# Altium schematic sheet Khoi_Sensor.SchDoc
size A4; SheetNumber: 3; SheetTotal: 6
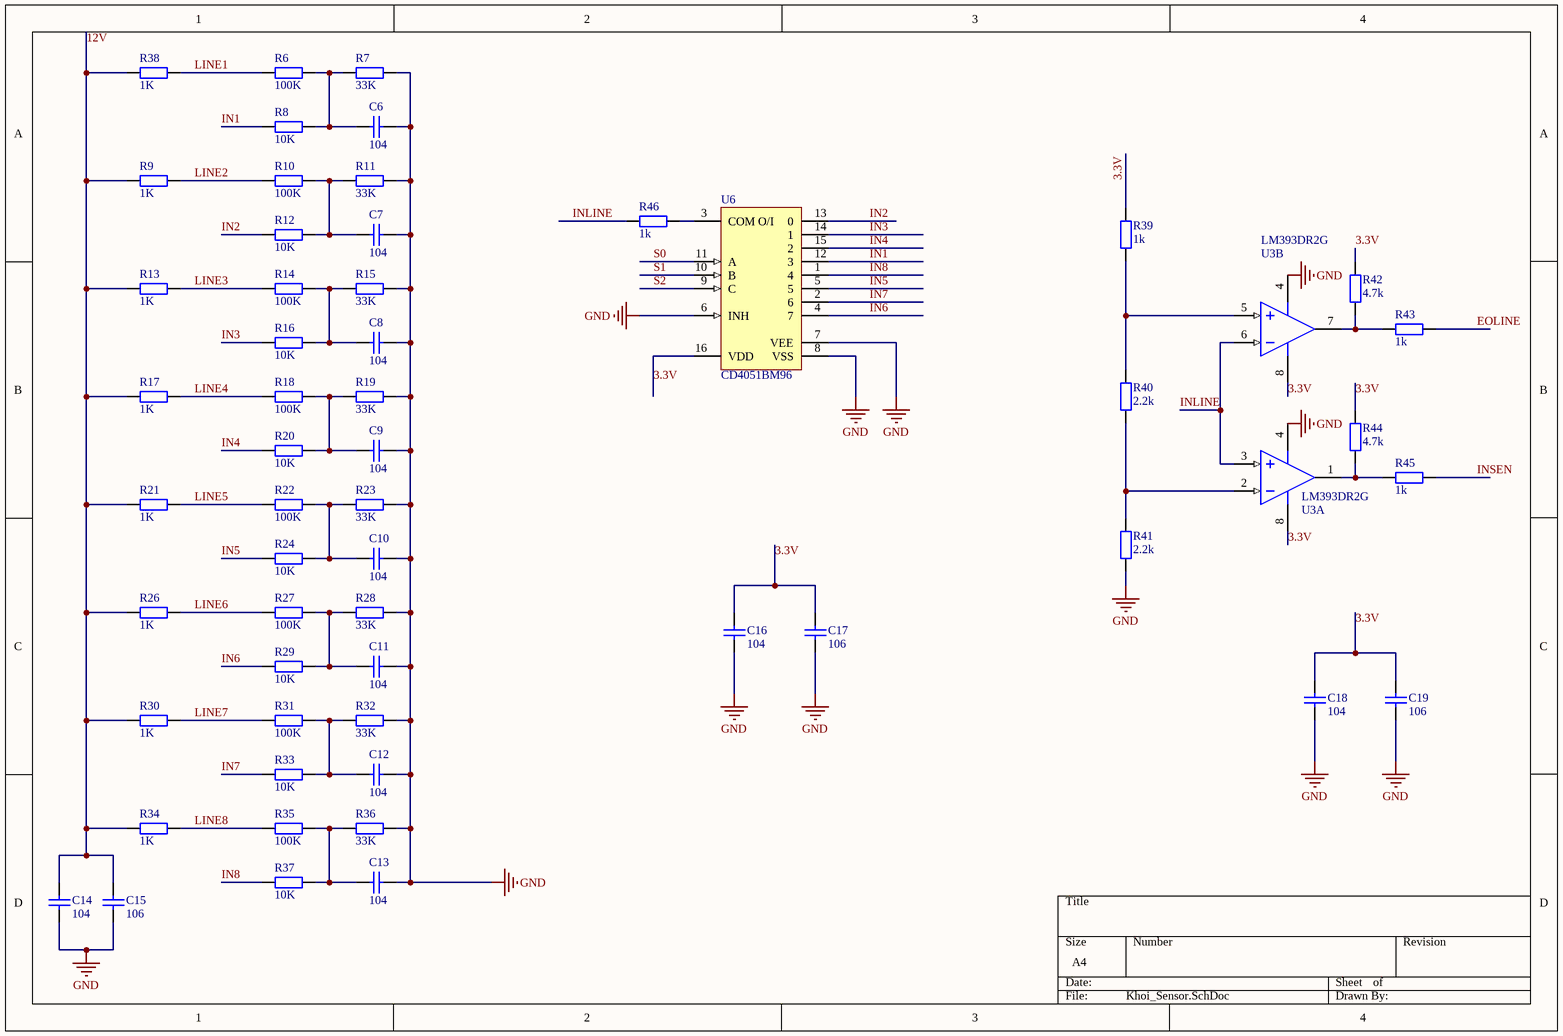
[diagram p0: Khoi_Sensor.SchDoc]

## Parts
C6  104  [tu 0603]
C7  104  [tu 0603]
C8  104  [tu 0603]
C9  104  [tu 0603]
C10  104  [tu 0603]
C11  104  [tu 0603]
C12  104  [tu 0603]
C13  104  [tu 0603]
C14  104  [tu 0603]
C15  106  [tu 0603]
C16  104  [tu 0603]
C17  106  [tu 0603]
C18  104  [tu 0603]
C19  106  [tu 0603]
R6  100K  [tro smd 0805]
R7  33K  [tro smd 0805]
R8  10K  [tro smd 0805]
R9  1K  [tro smd 0805]
R10  100K  [tro smd 0805]
R11  33K  [tro smd 0805]
R12  10K  [tro smd 0805]
R13  1K  [tro smd 0805]
R14  100K  [tro smd 0805]
R15  33K  [tro smd 0805]
R16  10K  [tro smd 0805]
R17  1K  [tro smd 0805]
R18  100K  [tro smd 0805]
R19  33K  [tro smd 0805]
R20  10K  [tro smd 0805]
R21  1K  [tro smd 0805]
R22  100K  [tro smd 0805]
R23  33K  [tro smd 0805]
R24  10K  [tro smd 0805]
R26  1K  [tro smd 0805]
R27  100K  [tro smd 0805]
R28  33K  [tro smd 0805]
R29  10K  [tro smd 0805]
R30  1K  [tro smd 0805]
R31  100K  [tro smd 0805]
R32  33K  [tro smd 0805]
R33  10K  [tro smd 0805]
R34  1K  [tro smd 0805]
R35  100K  [tro smd 0805]
R36  33K  [tro smd 0805]
R37  10K  [tro smd 0805]
R38  1K  [tro smd 0805]
R39  1k  [tro smd 0805]
R40  2.2k  [tro smd 0805]
R41  2.2k  [tro smd 0805]
R42  4.7k  [tro smd 0805]
R43  1k  [tro smd 0805]
R44  4.7k  [tro smd 0805]
R45  1k  [tro smd 0805]
R46  1k  [tro smd 0805]
U3  LM393DR2G  [ONSC-SOIC-8-751-07_V]  (parts A,B of 2)
U6  CD4051BM96  [D0016A_L]

## Nets
GND: C6.2 C7.2 C8.2 C9.2 C10.2 C11.2 C12.2 C13.2 C14.2 C15.2 C16.2 C17.2 C18.2 C19.2 R7.1 R11.1 R15.1 R19.1 R23.1 R28.1 R32.1 R36.1 R41.2 U3.4(GND) U6.6(INH) U6.7(VEE) U6.8(VSS)
3.3V: C16.1 C17.1 C18.1 C19.1 R39.1 R42.1 R44.1 U3.8(VCC) U6.16(VDD)
12V: C14.1 C15.1 R9.2 R13.2 R17.2 R21.2 R26.2 R30.2 R34.2 R38.2
EOLINE: R43.1
IN1: R8.2 U6.12(3)
IN2: R12.2 U6.13(0)
IN3: R16.2 U6.14(1)
IN4: R20.2 U6.15(2)
IN5: R24.2 U6.5
IN6: R29.2 U6.4(7)
IN7: R33.2 U6.2(6)
IN8: R37.2 U6.1(4)
INLINE: R46.1 U3.3(INA+) U3.6(INB-)
INSEN: R45.1
LINE1: R6.2 R38.1
LINE2: R9.1 R10.2
LINE3: R13.1 R14.2
LINE4: R17.1 R18.2
LINE5: R21.1 R22.2
LINE6: R26.1 R27.2
LINE7: R30.1 R31.2
LINE8: R34.1 R35.2
S0: U6.11(A)
S1: U6.10(B)
S2: U6.9(C)
NetC6_1: C6.1 R6.1 R7.2 R8.1
NetC7_1: C7.1 R10.1 R11.2 R12.1
NetC8_1: C8.1 R14.1 R15.2 R16.1
NetC9_1: C9.1 R18.1 R19.2 R20.1
NetC10_1: C10.1 R22.1 R23.2 R24.1
NetC11_1: C11.1 R27.1 R28.2 R29.1
NetC12_1: C12.1 R31.1 R32.2 R33.1
NetC13_1: C13.1 R35.1 R36.2 R37.1
NetR39_2: R39.2 R40.1 U3.5(INB+)
NetR40_2: R40.2 R41.1 U3.2(INA-)
NetR42_2: R42.2 R43.2 U3.7(OUTB)
NetR44_2: R44.2 R45.2 U3.1(OUTA)
NetR46_2: R46.2 U6.3(COM_O/I)

## Library data of the parts
C6-C14 C16 C18 = Tu 0603 104 50V 10%: Dán; Don_Vi: Con; So_Chan: 2; Ten_Linh_Kien: Tụ 0603 104-100nF 10% 50V; Ma_Hang: MH004568; Chung_Loai: Dán; Kieu_Chan: *
C15 C17 C19 = Tu 0603 106 16V 20%: Dán; Don_Vi: Con; So_Chan: 2; Ten_Linh_Kien: Tụ 0603-10uF 20% 16V; Ma_Hang: MH004848; Chung_Loai: Dán; Kieu_Chan: *
R6-R24 R26-R46 = Tro 0805 1% 2k: Dán; Don_Vi: Con; So_Chan: 2; Ten_Linh_Kien: Trở 0805 1% 2k; Ma_Hang: MH005471; Chung_Loai: Dán; Kieu_Chan: *
U3 = CMP-1305-00048-1: Low Offset Voltage Dual Comparators, 2 to 36 V, 0 to 70 degC, 8-Pin SOIC, Pb-Free, Tape and Reel; Manufacturer: On Semiconductor; VCC Min (V): 2; VCC Max (V): 36; ICC Typ (mA): 0.4; IO Typ (mA): 16; ComponentLink1Description: Manufacturer URL; ComponentLink2Description: Datasheet; Packing: Tape and Reel; PackageVersion: Rev. AK, 02/2011; RoHS: TRUE; Mounting Technology: Surface Mount; ComponentLink3URL: http://www.onsemi.com/pub_link/Collateral/751-07.PDF; PackageReference: SOIC-8-751-07; PackageDescription: 8-Pin Small Outline Integrated Circuit, Body 4.9 x 3.9 mm, Pitch 1.27 mm; ComponentLink3Description: Package Specification; ComponentLink1URL: http://www.onsemi.com/; PartNumber: LM393DR2G; DatasheetVersion: Rev. 25; ComponentLink2URL: http://www.onsemi.com/pub_link/Collateral/LM393-D.PDF
U6 = CMP-1575-00045-4: CMOS Single 8-Channel Analog Multiplexer/Demultiplexer with Logic-Level Conversion, D0016A, LARGE T&R; Manufacturer: Texas Instruments; Ron(Typ)(Ohms): 125; Bandwidth(Max)(MHz): 20; Ron(Max)(Ohms): 240; Crosstalk: Yes; Configuration: 1 X 1：8 MUX; ICC(Typ)(mA): 0.00008; VCC(Max)(V): 18; Rating: Military; VCC(Min)(V): 5; Output Drive (IOL/IOH)(Max)(mA): 1; Code_JEDEC: MS-012 variation AC; PackageReference: D0016A; PackageVersion: http://www.ti.com/lit/ml/mpds178g/mpds178g.pdf; Generic Part Number: CD4051B; Operating Temperature Range(C): -55 to 125; Output Type: CMOS; DatasheetVersion: SCHS047G